# EAGLE design driver (EAGLE 9.4.0)
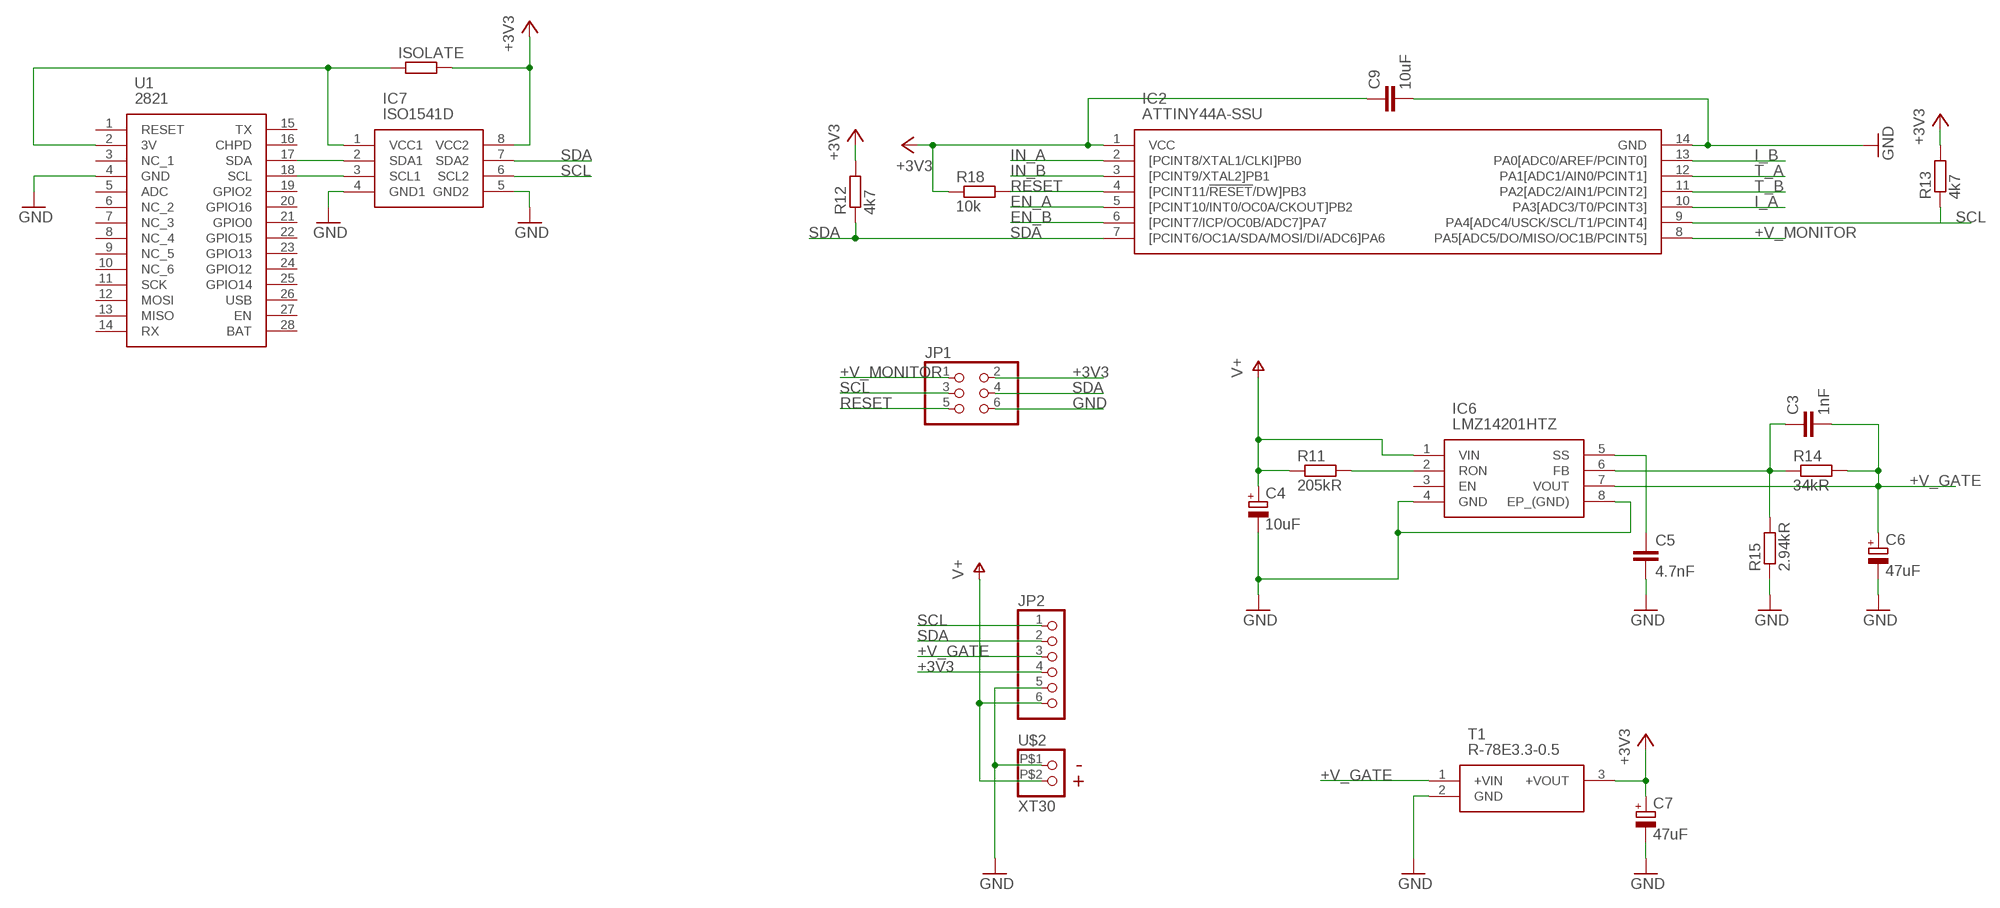
[diagram p0: schematic, sheet 1, part 1 of 2]
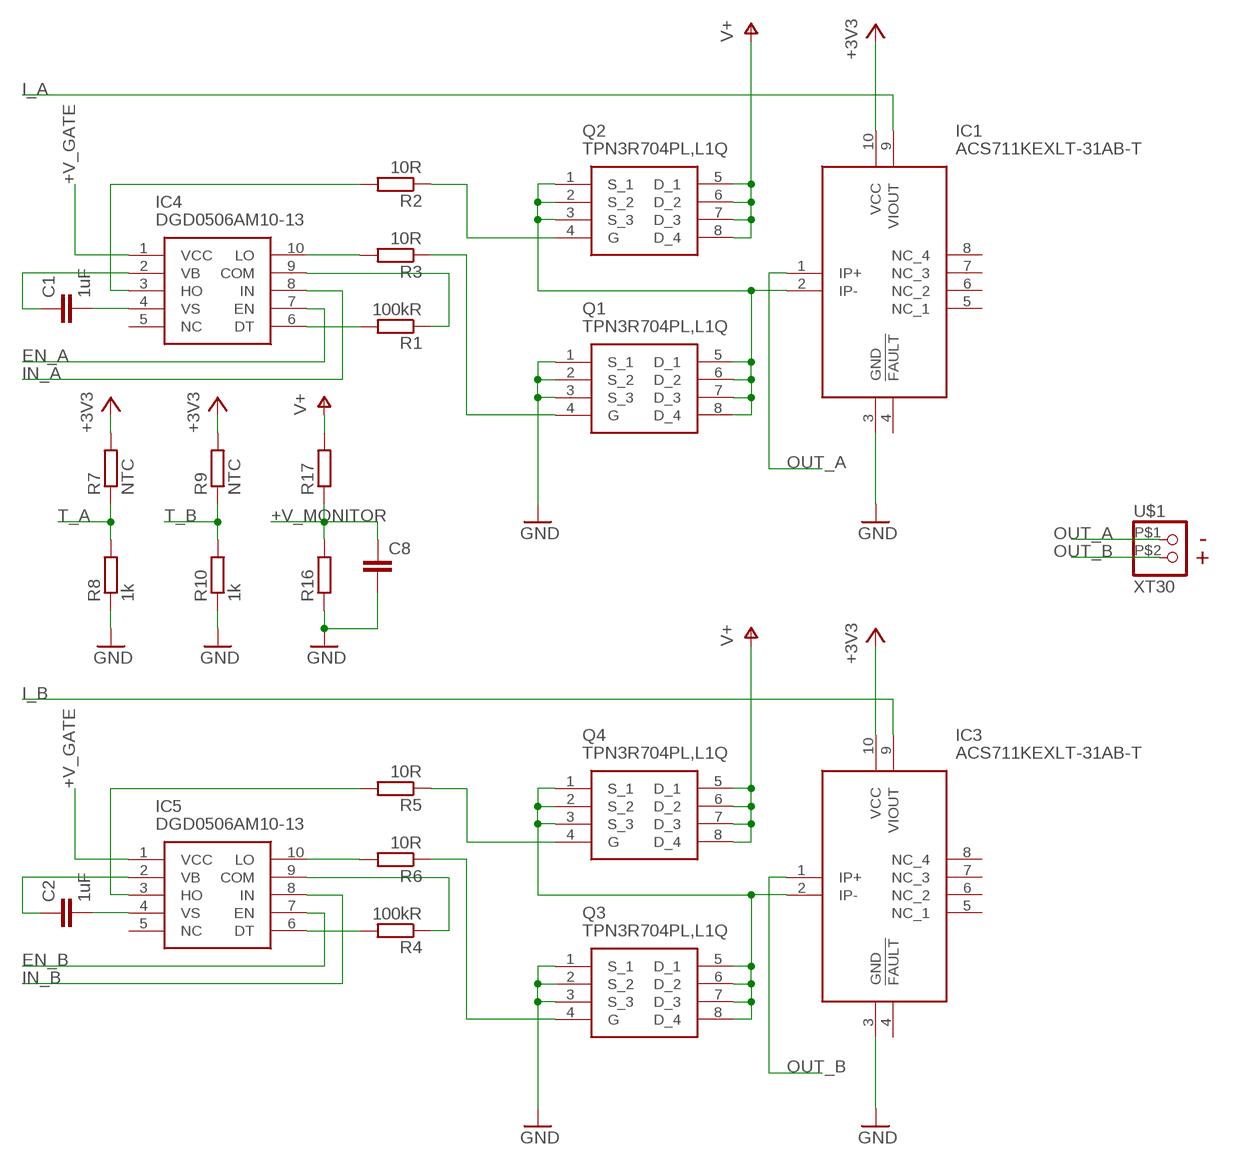
[diagram p1: schematic, sheet 1, part 2 of 2]

## Parts
C1  1uF  C-EUC0603  [C0603]
C2  1uF  C-EUC0603  [C0603]
C3  1nF  C-EUC0603  [C0603]
C4  10uF  CPOL-EUE2,5-6E  [E2,5-6E]
C5  4.7nF  C-EUC0603  [C0603]
C6  47uF  CPOL-EUE2,5-6E  [E2,5-6E]
C7  47uF  CPOL-EUE2,5-6E  [E2,5-6E]
C8  C-EUC0603  [C0603]
C9  10uF  C-EUC0603  [C0603]
IC1  ACS711KEXLT-31AB-T  [EX-PACKAGE]
IC2  ATTINY44A-SSU  [SOIC127P600X175-14N]
IC3  ACS711KEXLT-31AB-T  [EX-PACKAGE]
IC4  DGD0506AM10-13  [SOP50P490X110-10N]
IC5  DGD0506AM10-13  [SOP50P490X110-10N]
IC6  LMZ14201HTZ  [NDW0007A]
IC7  ISO1541D  [SOIC127P600X175-8N]
ISOLATE  R-EU_R0805  [R0805]
JP1  PINHD-2X3  [2X03]
JP2  PINHD-1X6  [1X06]
Q1  TPN3R704PL,L1Q  [TSON_ADVANCE]
Q2  TPN3R704PL,L1Q  [TSON_ADVANCE]
Q3  TPN3R704PL,L1Q  [TSON_ADVANCE]
Q4  TPN3R704PL,L1Q  [TSON_ADVANCE]
R1  100kR  R-EU_R0603  [R0603]
R2  10R  R-EU_R0603  [R0603]
R3  10R  R-EU_R0603  [R0603]
R4  100kR  R-EU_R0603  [R0603]
R5  10R  R-EU_R0603  [R0603]
R6  10R  R-EU_R0603  [R0603]
R7  NTC  R-EU_R0603  [R0603]
R8  1k  R-EU_R0603  [R0603]
R9  NTC  R-EU_R0603  [R0603]
R10  1k  R-EU_R0603  [R0603]
R11  205kR  R-EU_R0603  [R0603]
R12  4k7  R-EU_R0603  [R0603]
R13  4k7  R-EU_R0603  [R0603]
R14  34kR  R-EU_R0603  [R0603]
R15  2.94kR  R-EU_R0603  [R0603]
R16  R-EU_R0603  [R0603]
R17  R-EU_R0603  [R0603]
R18  10k  R-EU_R0603  [R0603]
T1  R-78E3.3-0.5  [SHDRV3W100P0_254_1X3_1160X850X]
U1  2821  [2821]
U$1  XT30  [XT30]
U$2  XT30  [XT30]

## Nets
+3V3: C7.+ C9.1 IC1.10(VCC) IC2.1(VCC) IC3.10(VCC) IC7.8(VCC2) ISOLATE.2 JP1.2 JP2.4 R7.2 R9.2 R12.2 R13.2 R18.1 T1.3(+VOUT)
+V_GATE: C3.2 C6.+ IC4.1(VCC) IC5.1(VCC) IC6.7(VOUT) JP2.3 R14.2 T1.1(+VIN)
+V_MONITOR: C8.1 IC2.8(PA5[ADC5/DO/MISO/OC1B/PCINT5]) JP1.1 R16.2 R17.1
EN_A: IC2.5([PCINT10/INT0/OC0A/CKOUT]PB2) IC4.7(EN)
EN_B: IC2.6([PCINT7/ICP/OC0B/ADC7]PA7) IC5.7(EN)
GND: C4.- C5.2 C6.- C7.- C8.2 C9.2 IC1.3(GND) IC2.14(GND) IC3.3(GND) IC6.4(GND) IC6.8(EP_(GND)) IC7.4(GND1) IC7.5(GND2) JP1.6 JP2.5 Q1.1(S_1) Q1.2(S_2) Q1.3(S_3) Q3.1(S_1) Q3.2(S_2) Q3.3(S_3) R8.1 R10.1 R15.1 R16.1 T1.2(GND) U1.4(GND) U$2.P$1
I_A: IC1.9(VIOUT) IC2.10(PA3[ADC3/T0/PCINT3])
I_B: IC2.13(PA0[ADC0/AREF/PCINT0]) IC3.9(VIOUT)
IN_A: IC2.2([PCINT8/XTAL1/CLKI]PB0) IC4.8(IN)
IN_B: IC2.3([PCINT9/XTAL2]PB1) IC5.8(IN)
N$1: IC3.2(IP-) Q3.5(D_1) Q3.6(D_2) Q3.7(D_3) Q3.8(D_4) Q4.1(S_1) Q4.2(S_2) Q4.3(S_3)
N$2: Q2.4(G) R2.1
N$3: C1.2 IC4.4(VS)
N$4: C1.1 IC4.2(VB)
N$5: Q4.4(G) R5.1
N$6: IC1.2(IP-) Q1.5(D_1) Q1.6(D_2) Q1.7(D_3) Q1.8(D_4) Q2.1(S_1) Q2.2(S_2) Q2.3(S_3)
N$7: Q1.4(G) R3.1
N$8: IC4.6(DT) R1.2
N$9: IC4.9(COM) R1.1
N$10: IC4.3(HO) R2.2
N$11: IC4.10(LO) R3.2
N$12: C2.2 IC5.4(VS)
N$13: C2.1 IC5.2(VB)
N$14: Q3.4(G) R6.1
N$15: IC5.6(DT) R4.2
N$16: IC5.9(COM) R4.1
N$17: IC5.3(HO) R5.2
N$18: IC5.10(LO) R6.2
N$19: IC7.2(SDA1) U1.17(SDA)
N$20: IC6.2(RON) R11.2
N$21: C3.1 IC6.6(FB) R14.1 R15.2
N$22: C5.1 IC6.5(SS)
N$23: IC7.3(SCL1) U1.18(SCL)
N$24: IC7.1(VCC1) ISOLATE.1 U1.2(3V)
OUT_A: IC1.1(IP+) U$1.P$1
OUT_B: IC3.1(IP+) U$1.P$2
RESET: IC2.4([PCINT11/!RESET!/DW]PB3) JP1.5 R18.2
SCL: IC2.9(PA4[ADC4/USCK/SCL/T1/PCINT4]) IC7.6(SCL2) JP1.3 JP2.1 R13.1
SDA: IC2.7([PCINT6/OC1A/SDA/MOSI/DI/ADC6]PA6) IC7.7(SDA2) JP1.4 JP2.2 R12.1
T_A: IC2.12(PA1[ADC1/AIN0/PCINT1]) R7.1 R8.2
T_B: IC2.11(PA2[ADC2/AIN1/PCINT2]) R9.1 R10.2
V+: C4.+ IC6.1(VIN) JP2.6 Q2.5(D_1) Q2.6(D_2) Q2.7(D_3) Q2.8(D_4) Q4.5(D_1) Q4.6(D_2) Q4.7(D_3) Q4.8(D_4) R11.1 R17.2 U$2.P$2
Unconnected: IC1.4(!FAULT) IC1.5(NC_1) IC1.6(NC_2) IC1.7(NC_3) IC1.8(NC_4) IC3.4(!FAULT) IC3.5(NC_1) IC3.6(NC_2) IC3.7(NC_3) IC3.8(NC_4) IC4.5(NC) IC5.5(NC) IC6.3(EN) U1.1(RESET) U1.3(NC_1) U1.5(ADC) U1.6(NC_2) U1.7(NC_3) U1.8(NC_4) U1.9(NC_5) U1.10(NC_6) U1.11(SCK) U1.12(MOSI) U1.13(MISO) U1.14(RX) U1.15(TX) U1.16(CHPD) U1.19(GPIO2) U1.20(GPIO16) U1.21(GPIO0) U1.22(GPIO15) U1.23(GPIO13) U1.24(GPIO12) U1.25(GPIO14) U1.26(USB) U1.27(EN) U1.28(BAT)

## Library data of the parts
C1-C3 C5 C8 C9 = rcl:C-EU: CAPACITOR, European symbol; SPICEPREFIX: C
C4 C6 C7 = rcl:CPOL-EU: POLARIZED CAPACITOR, European symbol; SPICEPREFIX: C
IC1 IC3 = parts:ACS711KEXLT-31AB-T: Hall-Effect Linear Current Sensor with Overcurrent Fault Output for < 100 V Isolation Applications Source: Datasheet <http://www.allegromicro.com/en/Products/Current-Sensor-ICs/Zero-To-Fifty-Amp-Integrated-Conductor-Sensor-ICs/~/media/Files/Datasheets/ACS711-Datasheet.pdf>; DESCRIPTION: Hall-Effect Linear Current Sensor with Overcurrent Fault Output for < 100 V Isolation Applications; HEIGHT: mm; MANUFACTURER_NAME: Allegro Microsystems; MANUFACTURER_PART_NUMBER: ACS711KEXLT-31AB-T
IC2 = parts:ATTINY44A-SSU: ATTINY44A-SSU, 8 bit AVR Microcontroller 20MHz 256 B, 4 kB Flash, 256 B RAM, I2C 14-Pin SOIC Source: Datasheet <http://www.atmel.com/Images/doc8183.pdf>; DESCRIPTION: ATTINY44A-SSU, 8 bit AVR Microcontroller 20MHz 256 B, 4 kB Flash, 256 B RAM, I2C 14-Pin SOIC; HEIGHT: 1.75mm; MANUFACTURER_NAME: Microchip; MANUFACTURER_PART_NUMBER: ATTINY44A-SSU; MOUSER_PART_NUMBER: 556-ATTINY44A-SSU; MOUSER_PRICE-STOCK: https://www.mouser.com/Search/Refine.aspx?Keyword=556-ATTINY44A-SSU; RS_PART_NUMBER: 1331640P; RS_PRICE-STOCK: http://uk.rs-online.com/web/p/products/1331640P
IC4 IC5 = parts:DGD0506AM10-13: Gate Drivers HV Gate Driver MSOP-10 T&R 2.5K Source: Datasheet <https://www.diodes.com/assets/Datasheets/DGD0506A.pdf>; DESCRIPTION: Gate Drivers HV Gate Driver MSOP-10 T&R 2.5K; HEIGHT: 1.1mm; MANUFACTURER_NAME: Diodes Inc.; MANUFACTURER_PART_NUMBER: DGD0506AM10-13; MOUSER_PART_NUMBER: 621-DGD0506AM10-13; MOUSER_PRICE-STOCK: https://www.mouser.com/Search/Refine.aspx?Keyword=621-DGD0506AM10-13; RS_PART_NUMBER: 1827336P; RS_PRICE-STOCK: http://uk.rs-online.com/web/p/products/1827336P
IC6 = parts:LMZ14201HTZ: TEXAS INSTRUMENTS - LMZ14201HTZ - POWER MODULE, 42V, 1A, 7TOPMOD Source: Datasheet <http://www.ti.com/lit/ds/symlink/lmz14201h.pdf>; DESCRIPTION: TEXAS INSTRUMENTS - LMZ14201HTZ - POWER MODULE, 42V, 1A, 7TOPMOD; HEIGHT: mm; MANUFACTURER_NAME: Texas Instruments; MANUFACTURER_PART_NUMBER: LMZ14201HTZ
IC7 = parts:ISO1541D: 2.5 kVrms Isolated Unidirectional Clock, Bidirectional I2C Isolators Source: Datasheet <http://www.ti.com/lit/gpn/iso1541>; DESCRIPTION: 2.5 kVrms Isolated Unidirectional Clock, Bidirectional I2C Isolators; HEIGHT: 1.75mm; MANUFACTURER_NAME: Texas Instruments; MANUFACTURER_PART_NUMBER: ISO1541D; MOUSER_PART_NUMBER: 595-ISO1541D; MOUSER_PRICE-STOCK: https://www.mouser.com/Search/Refine.aspx?Keyword=595-ISO1541D; RS_PART_NUMBER: 8253075P; RS_PRICE-STOCK: http://uk.rs-online.com/web/p/products/8253075P
ISOLATE R1-R18 = rcl:R-EU_: RESISTOR, European symbol; SPICEPREFIX: R
JP1 = pinhead:PINHD-2X3: PIN HEADER
JP2 = pinhead:PINHD-1X6: PIN HEADER
Q1-Q4 = parts:TPN3R704PL,L1Q: MOSFET 40 Volt N-Channel Source: Datasheet <https://toshiba.semicon-storage.com/info/docget.jsp?did=30643&prodName=TPN3R704PL>; DESCRIPTION: MOSFET 40 Volt N-Channel; HEIGHT: mm; MANUFACTURER_NAME: Toshiba; MANUFACTURER_PART_NUMBER: TPN3R704PL,L1Q; MOUSER_PART_NUMBER: 757-TPN3R704PLL1Q; MOUSER_PRICE-STOCK: https://www.mouser.com/Search/Refine.aspx?Keyword=757-TPN3R704PLL1Q
T1 = parts:R-78E3.3-0.5: Switching Regulator 6-28Vin 3.3Vout 0.5A Switching Regulator, 6 Source: Datasheet <http://www.recom-power.com/pdf/Innoline/R-78Exx-0.5.pdf>; DESCRIPTION: Switching Regulator 6-28Vin 3.3Vout 0.5A Switching Regulator, 6; HEIGHT: 10.4mm; MANUFACTURER_NAME: RECOM Power; MANUFACTURER_PART_NUMBER: R-78E3.3-0.5; MOUSER_PART_NUMBER: 919-R-78E3.3-0.5; MOUSER_PRICE-STOCK: https://www.mouser.com/Search/Refine.aspx?Keyword=919-R-78E3.3-0.5; RS_PART_NUMBER: 1666497; RS_PRICE-STOCK: http://uk.rs-online.com/web/p/products/1666497
U1 = parts:2821: ADAFRUIT - 2821 - Adafruit Feather HUZZAH ESP8266 Source: Datasheet <https://cdn-learn.adafruit.com/downloads/pdf/adafruit-feather-huzzah-esp8266.pdf>; ALLIED_NUMBER: 70929322; ALLIED_PRICE-STOCK: https://www.alliedelec.com/adafruit-industries-2821/70929322/; DESCRIPTION: ADAFRUIT - 2821 - Adafruit Feather HUZZAH ESP8266; HEIGHT: 4mm; MANUFACTURER_NAME: Adafruit; MANUFACTURER_PART_NUMBER: 2821; MOUSER_PART_NUMBER: 485-2821; MOUSER_PRICE-STOCK: https://www.mouser.com/Search/Refine.aspx?Keyword=485-2821; RS_PART_NUMBER: 1245505; RS_PRICE-STOCK: http://uk.rs-online.com/web/p/products/1245505
U$1 U$2 = parts:XT30

## Board
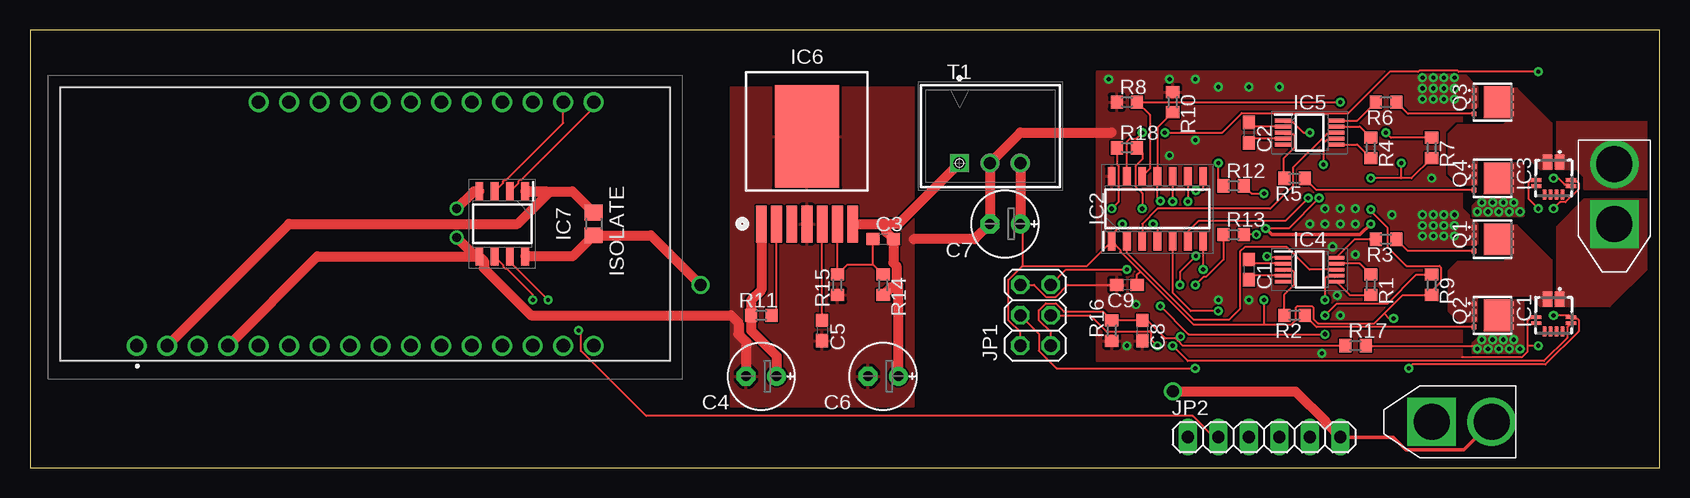
[diagram p2: board, top side]
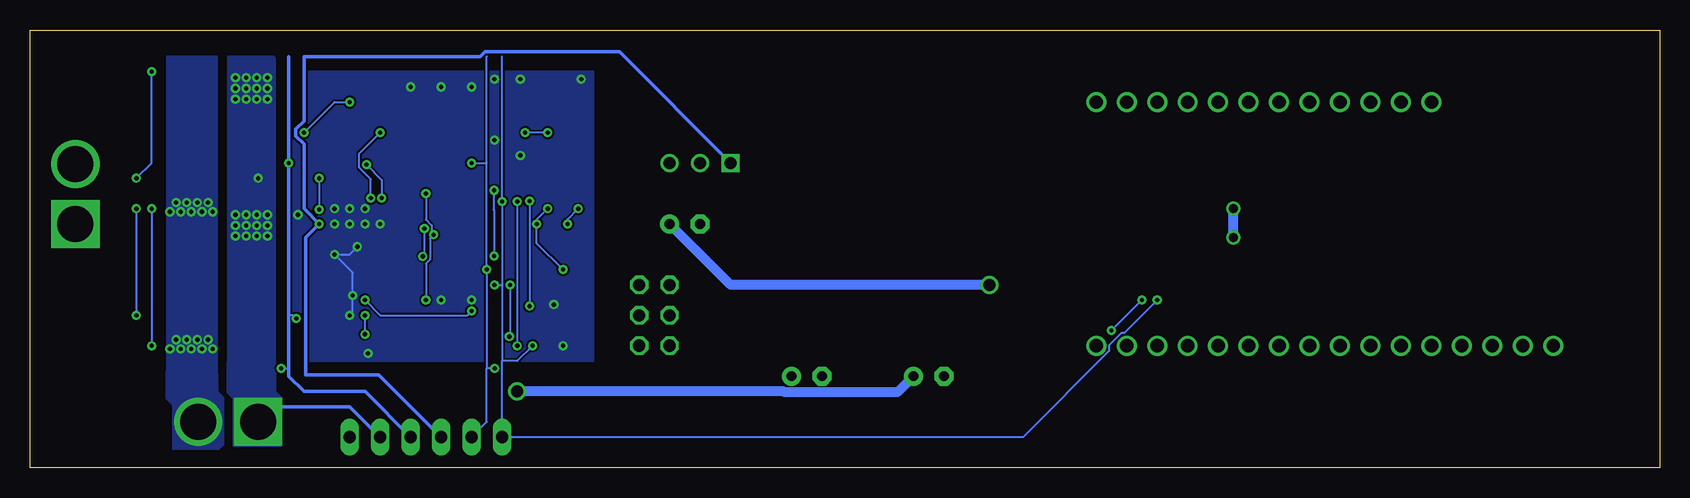
[diagram p3: board, bottom side, seen from below]

Size 135.87 x 36.5 mm. Coordinates in mm from the lower left corner, seen from the top.
Outline: 0,0 135.87,0 135.87,36.5 0,36.5 0,0
Copper layers (1*16): Top 0.035mm / dielectric 1.5mm / Bottom 0.035mm
Design rules "default": minimum track width 6mil, minimum drill 0.35mm, track to track 6mil, track to pad 6mil, pad to pad 6mil, via to via 6mil, smd to smd 6mil, copper to edge 40mil, drill to drill 6mil, minimum pad ring 10mil, minimum via ring 8mil, stop-mask expansion 4mil, vias tented up to drill 0mil, thermal gap 10mil

### Footprints (pad centres in the part's own frame; a part is rotated, then mirrored left to right if it is on the bottom)
C0603 = smd 1.1 x 1: 1 -0.85,0; 2 0.85,0
E2,5-6E = drill 0.813 pad 1.575: + -1.27,0 | drill 0.813 pad 1.575 octagon: - 1.27,0
EX-PACKAGE = smd 1.27 x 0.8: 1 -1.35,0.5; 2 -1.35,-0.5 | smd 0.3 x 0.85: 3 0.15,-1.45; 4 0.65,-1.45; 9 0.65,1.45; 10 0.15,1.45 | smd 0.85 x 0.3: 5 1.35,-0.75; 6 1.35,-0.25; 7 1.35,0.25; 8 1.35,0.75
SOIC127P600X175-14N = smd 1.528 x 0.65: 1 -2.711,3.81; 2 -2.711,2.54; 3 -2.711,1.27; 4 -2.711,0; 5 -2.711,-1.27; 6 -2.711,-2.54; 7 -2.711,-3.81; 8 2.711,-3.81; 9 2.711,-2.54; 10 2.711,-1.27; 11 2.711,0; 12 2.711,1.27; 13 2.711,2.54; 14 2.711,3.81
SOP50P490X110-10N = smd 1.4 x 0.3: 1 -2.2,1; 2 -2.2,0.5; 3 -2.2,0; 4 -2.2,-0.5; 5 -2.2,-1; 6 2.2,-1; 7 2.2,-0.5; 8 2.2,0; 9 2.2,0.5; 10 2.2,1
NDW0007A = smd 0.89 x 3.06: 1 -3.81,0; 2 -2.54,0; 3 -1.27,0; 4 0,0; 5 1.27,0; 6 2.54,0; 7 3.81,0 | smd 5.35 x 8.54: 8 0,7.305
SOIC127P600X175-8N = smd 1.525 x 0.65: 1 -2.712,1.905; 2 -2.712,0.635; 3 -2.712,-0.635; 4 -2.712,-1.905; 5 2.712,-1.905; 6 2.712,-0.635; 7 2.712,0.635; 8 2.712,1.905
R0805 = smd 1.3 x 1.5: 1 -0.95,0; 2 0.95,0
2X03 = drill 1.016 octagon: 1 -2.54,-1.27; 2 -2.54,1.27; 3 0,-1.27; 4 0,1.27; 5 2.54,-1.27; 6 2.54,1.27
1X06 = drill 1.016 long: 1 -6.35,0; 2 -3.81,0; 3 -1.27,0; 4 1.27,0; 5 3.81,0; 6 6.35,0
TSON_ADVANCE = smd 0.4 x 0.4: 1 -0.975,-1.55; 2 -0.325,-1.55; 3 0.325,-1.55; 4 0.975,-1.55 | smd 0.4 x 0.3: 5 0.975,1.6; 6 0.325,1.6; 7 -0.325,1.6; 8 -0.975,1.6 | smd 2.65 x 2.2: 9 0,0.35
R0603 = smd 1 x 1.1: 1 -0.85,0; 2 0.85,0
SHDRV3W100P0_254_1X3_1160X850X = drill 1 pad 1.5 square: 1 0,0 | drill 1 pad 1.5: 2 2.54,0; 3 5.08,0
2821 = drill 1.11 pad 1.665: 1 -35.56,0; 2 -33.02,0; 3 -30.48,0; 4 -27.94,0; 5 -25.4,0; 6 -22.86,0; 7 -20.32,0; 8 -17.78,0; 9 -15.24,0; 10 -12.7,0; 11 -10.16,0; 12 -7.62,0; 13 -5.08,0; 14 -2.54,0; 15 0,0; 16 2.54,0; 17 2.54,20.32; 18 0,20.32; 19 -2.54,20.32; 20 -5.08,20.32; 21 -7.62,20.32; 22 -10.16,20.32; 23 -12.7,20.32; 24 -15.24,20.32; 25 -17.78,20.32; 26 -20.32,20.32; 27 -22.86,20.32; 28 -25.4,20.32
XT30 = drill 3 square: P$1 0,0 | drill 3: P$2 5,0

### Placement (x,y rotation side)
C1  101.6,16.51 270 top
C2  101.6,27.94 270 top
C3  71.12,19.05 0 top
C4  60.96,7.62 180 top
C5  66.04,11.43 270 top
C6  71.12,7.62 180 top
C7  81.28,20.32 180 top
C8  92.71,11.43 270 top
C9  91.44,15.24 180 top
IC1  127,12.7 270 top
IC2  93.98,21.59 90 top
IC3  127,24.13 270 top
IC4  106.68,16.51 0 top
IC5  106.68,27.94 0 top
IC6  64.77,20.32 0 top
IC7  39.37,20.32 270 top
ISOLATE  46.99,20.32 270 top
JP1  83.82,12.7 90 top
JP2  102.87,2.54 0 top
Q1  121.92,19.05 270 top
Q2  121.92,12.7 270 top
Q3  121.92,30.48 270 top
Q4  121.92,24.13 270 top
R1  111.76,15.24 270 top
R2  105.41,12.7 180 top
R3  113.03,19.05 180 top
R4  111.76,26.67 270 top
R5  105.41,24.13 180 top
R6  113.03,30.48 180 top
R7  116.84,26.67 270 top
R8  91.44,30.48 0 top
R9  116.84,15.24 270 top
R10  95.25,30.48 270 top
R11  60.96,12.7 0 top
R12  100.33,23.49 0 top
R13  100.33,19.43 0 top
R14  71.12,15.24 270 top
R15  67.31,15.24 90 top
R16  90.17,11.43 90 top
R17  110.49,10.16 0 top
R18  91.44,26.67 0 top
T1  77.47,25.4 0 top
U1  44.45,10.16 0 top
U$1  132.08,20.32 90 top
U$2  116.84,3.81 0 top

### Tracks (layer width: path | path; a pad name or v marks a point on that pad's centre or on a via)
+3V3  (via drill 0.35, 1)
  Top 0.152: IC2.1 90.89,18.16 90.89,18.02 92.55,16.35 | 92.55,16.35 96.98,11.92 102.87,11.92 | 102.87,11.92 105.16,11.92 105.53,12.3 105.53,13.34 105.67,13.48 106.86,13.48 106.99,13.34 106.99,12.4 107.36,12.03 112.07,12.03 112.88,12.85 | 112.88,12.85 114.43,14.39 R9.2 116.84,14.72 117.62,15.5 117.62,16.68 117.48,16.82 114.74,16.82 113.15,18.41 113.15,20.01 111.76,21.4 v111.76,21.53 | v127,21.59 127.54,22.13 128,22.13 129.1,23.23 129.1,23.72 128.97,23.86 128.57,23.86 IC3.10 | R7.2 115.15,24.13 114.3,24.13 | 114.3,24.13 v111.76,24.13 | v113.67,12.45 113.28,12.45 112.88,12.85 | 114.3,24.13 v114.3,25.4 | v114.94,8.28 115.24,8.59 126.31,8.59 129.1,11.37 129.1,12.3 128.97,12.43 128.57,12.43 IC1.10 128.3,12.7 v127,12.7 | R12.2 101.81,22.86 v102.87,22.86 | v102.23,19.42 R13.2 | v102.87,13.97 102.87,11.92 | C9.1 92.29,16.09 92.55,16.35 | R18.1 90.59,25.29 90.72,25.16 90.72,22.14 v90.17,21.59 | v91.06,20.32 90.17,19.43 IC2.1 | IC2.1 88.11,16.82 82.72,16.82 | 82.72,16.82 81.56,15.65 81.56,12.29 82.55,11.3 JP1.2 | C7.+ 82.72,20.15 82.72,16.82
  Top 0.813: T1.3 C7.+ | IC7.8 45.23,17.61 ISOLATE.2 51.75,19.37 v55.88,15.24
  Bottom 0.152: v127,21.59 v127,12.7 | v111.76,24.13 v111.76,21.53 | v113.67,12.45 113.92,12.7 114.3,12.7 | v114.94,8.28 114.33,8.28 114.3,8.25 | v102.87,22.86 102.87,20.67 102.39,20.19 102.39,19.59 v102.23,19.42 102.52,19.13 102.52,17.36 102.87,17.01 v102.87,13.97 | v91.06,20.32 91.06,20.7 v90.17,21.59
  Bottom 0.305: 114.3,34.29 v114.3,25.4 114.3,12.7 114.3,8.25 114.3,7.62 113.03,6.35 107.95,6.35 JP2.4
  Bottom 0.813: v55.88,15.24 77.47,15.24 C7.+
+V_GATE  (via drill 0.35)
  Top 0.152: IC4.1 103.23,17.51 v103.12,17.62 | IC5.1 104.6,28.82 105.28,28.82 106.15,27.94 v106.68,27.94 | v107.46,22.48 104.92,19.94 v103,19.94
  Top 0.305: v103,19.94 103.5,19.43 110.87,19.43 v111.76,20.32
  Top 0.813: IC6.7 70.84,20.32 | 70.84,20.32 71.38,19.78 71.38,19.64 C3.2 71.97,17.08 72.23,16.82 72.23,15.36 | 72.23,15.36 71.9,15.03 71.76,15.03 R14.2 | C6.+ 72.39,15.2 72.23,15.36 | T1.1 72.39,20.32 70.84,20.32
  Bottom 0.152: v103,19.94 103,17.74 v103.12,17.62 | v107.46,22.48 107.46,24.05 108.43,25.02 108.43,26.19 v106.68,27.94
  Bottom 0.305: JP2.3 106.81,7.75 112.9,7.75 112.9,19.18 v111.76,20.32 113.03,21.59 113.03,26.97 113.71,27.66 113.71,28.22 113.03,28.91 113.03,34.29 98.33,34.29 97.95,34.67 86.74,34.67 T1.1
+V_MONITOR  (via drill 0.35)
  Top 0.152: R17.1 96.11,10.16 95.68,10.59 | 95.68,10.59 95.5,10.77 94.64,10.77 92.71,12.7 C8.1 90.59,12.28 90.17,12.7 R16.2 89.44,13 86.19,13 85.5,13.69 84.68,13.69 84.1,13.11 84.1,12.29 85.09,11.3 JP1.1 | IC2.8 97.79,23.12 v97.18,23.12 | v97.18,17.65 95.86,16.32 v95.86,15.24 | v95.91,10.93 95.91,10.82 95.68,10.59
  Bottom 0.152: v97.18,23.12 97.18,22.9 97.23,22.9 97.23,21.49 97.18,21.49 v97.18,17.65 | v95.86,15.24 95.86,10.98 v95.91,10.93
EN_A  (via drill 0.35)
  Top 0.152: IC4.7 108.76,15.89 108.08,15.89 107.95,15.75 v107.95,13.97 | v99.05,13.05 96.76,13.05 95.25,14.57 IC2.5
  Bottom 0.152: v107.95,13.97 106.68,12.7 99.4,12.7 v99.05,13.05
EN_B  (via drill 0.35)
  Top 0.152: IC5.7 108.76,27.32 108.08,27.32 107.82,27.06 v107.82,25.27 | v106.55,22.47 104.65,20.57 97.41,20.57 96.52,19.68 IC2.6
  Bottom 0.152: v107.82,25.27 106.55,24 v106.55,22.47
GND  (via drill 0.35, 0.75)
  Top 0.152: IC1.3 125.43,12.43 125.03,12.43 124.81,12.21 124.81,10.16 | 124.81,10.16 124.81,9.66 124.35,9.2 119.38,9.2 | IC3.3 125.43,23.86 125.03,23.86 124.9,23.72 124.9,22.42 v125.73,21.59 | v125.73,10.16 124.81,10.16 | JP1.6 83.69,15.24 84.68,14.25 85.5,14.25 86.49,15.24 C9.2
  Top 0.813: 73.66,19.05 78.74,19.05 C7.- T1.2 82.55,27.94 90.17,27.94 | U1.4 23.96,17.61 IC7.5 | IC7.5 37.85,17.22 37.85,16.61 41.77,12.7 58.42,12.7 59.05,12.07 59.05,11.12 59.69,10.48 C4.- | IC7.5 37.13,17.61 v35.56,19.18 | v35.56,21.59 37,23.03 IC7.4
  Bottom 0.152: v125.73,21.59 v125.73,10.16 | v109.22,12.7 108.97,12.95 v108.97,14.35 108.97,16.26 v110.49,17.78 109.22,17.78 v108.58,18.41
  Bottom 0.305: JP2.5 109.22,5.08 115.57,5.08 U$2.P$1
  Bottom 0.813: v35.56,19.18 v35.56,21.59
  other vias: 116.08,21.08 116.97,21.08 117.86,21.08 118.75,21.08 116.08,20.19 116.97,20.19 117.86,20.19 118.75,20.19 116.08,19.3 116.97,19.3 117.86,19.3 118.75,19.3 116.08,32.51 116.97,32.51 117.86,32.51 118.75,32.51 116.08,31.62 116.97,31.62 117.86,31.62 118.75,31.62 116.08,30.73 116.97,30.73 117.86,30.73 118.75,30.73 116.84,24.13 99.06,13.97 101.6,13.97 109.22,21.59 110.49,21.59 107.95,21.59 106.68,20.32 107.95,20.32 109.22,20.32 110.49,20.32 107.7,9.53 92.2,13.59 89.92,32.38 95,32.38 95,26.04 97.16,32.38 97.16,27.3 113.54,21.08 99.06,31.75 101.6,31.75 104.14,31.75 91.44,10.16
  pour Top (rank 2, no thermals): 120.52,29.97 116.08,29.97 115.57,30.48 115.57,33.02 119.38,33.02 120.65,31.75 120.65,30.1
  pour Top (rank 2, no thermals): 120.52,18.54 116.08,18.54 115.57,19.05 115.57,21.59 119.38,21.59 120.65,20.32 120.65,18.67
  pour Bottom (rank 2): 119.38,34.29 119.38,7.62 115.44,7.62 115.44,34.16 115.57,34.29
  pour Top (rank 3): 119.38,33.02 88.9,33.02 88.9,8.89 119.38,8.89
  pour Bottom (rank 3): 88.9,33.02 115.57,33.02 115.57,8.89 88.9,8.89
  pour Top (rank 4): 58.42,31.75 73.66,31.75 73.66,5.08 58.42,5.08
  pour Bottom (no thermals): 115.44,8.76 115.44,6.35 114.94,5.84 114.94,1.78 118.87,1.78 118.87,5.71 119.38,6.22 119.38,8.76
I_A  (via drill 0.35)
  Top 0.152: IC1.9 128.13,11.73 128.13,10.83 126.19,8.89 96.52,8.89 v95.25,10.16 | v95.25,22.2 IC2.10
  Bottom 0.152: v95.25,22.2 v95.25,10.16
I_B  (via drill 0.35)
  Top 0.152: v92.71,27.94 92.22,27.45 91.69,27.45 91.44,27.19 IC2.13 | v94.59,27.94 99.38,27.94 101,29.57 109.89,29.57 113.35,33.02 115.73,33.02 115.83,33.12 119,33.12 119.09,33.02 v125.73,33.02 | IC3.9 128.33,23.6 127.93,23.6 127.4,24.13 v127,24.13
  Bottom 0.152: v92.71,27.94 v94.59,27.94 | v127,24.13 125.73,25.4 v125.73,33.02
IN_A
  Top 0.152: IC4.8 106.65,16.51 104.77,18.39 101.26,18.39 100.87,18 100.87,13.24 99.95,12.32 97.02,12.32 91.44,17.9 IC2.2
IN_B
  Top 0.152: IC5.8 108.76,27.82 108.08,27.82 105.29,25.02 105.29,23.48 103.39,21.59 93.98,21.59 92.71,20.32 IC2.3
N$1
  pour Top (isolate 0.152, no thermals): 119.13,23.62 120.65,23.62 120.65,25.65 120.78,25.78 124.97,25.78 125.86,24.89 126.87,24.89 126.87,28.7 123.95,31.62 123.32,31.62 123.32,29.08 122.81,28.57 119,28.57 118.24,27.81 118.24,24.51
N$2
  Top 0.152: Q2.4 107.23,11.73 R2.1
N$3
  Top 0.152: IC4.4 101.95,16.01 C1.2
N$4
  Top 0.152: IC4.2 101.95,17.01 C1.1
N$5
  Top 0.152: Q4.4 107.23,23.15 R5.1
N$6
  pour Top (isolate 0.152, no thermals): 119.13,12.19 120.65,12.19 120.65,14.22 120.78,14.35 124.97,14.35 125.86,13.46 126.87,13.46 126.87,17.27 123.95,20.19 123.32,20.19 123.32,17.65 122.81,17.14 119,17.14 118.24,16.38 118.24,13.08
N$7
  Top 0.152: Q1.4 114.86,18.07 R3.1
N$8
  Top 0.152: IC4.6 110,14.39 R1.2
N$9
  Top 0.152: R1.1 110.84,17.01 IC4.9
N$10
  Top 0.152: R2.2 104.56,14.42 105.41,15.27 105.41,16.25 105.28,16.39 104.6,16.39 IC4.3
N$11
  Top 0.152: IC4.10 110.42,19.05 R3.2
N$12
  Top 0.152: IC5.4 101.6,27.44 C2.2
N$13
  Top 0.152: IC5.2 101.6,28.44 C2.1
N$14
  Top 0.152: Q3.4 114.86,29.5 R6.1
N$15
  Top 0.152: IC5.6 110.64,26.94 R4.2
N$16
  Top 0.152: IC5.9 110.84,28.44 R4.1
N$17
  Top 0.152: R5.2 104.48,24.21 104.48,25.77 105.41,26.7 105.41,27.68 105.28,27.82 104.6,27.82 IC5.3
N$18
  Top 0.152: IC5.10 110.64,28.94 R6.2
N$19
  Top 0.152: U1.17 46.99,30.02 41,24.02 40.85,24.02 40.72,23.89 40.72,23.75 IC7.2
N$20
  Top 0.152: R11.2 62.23,13.12 IC6.2
N$21
  Top 0.152: IC6.6 R15.2 68.16,16.93 70.28,16.93 | R14.1 70.28,16.93 | 70.28,16.93 70.27,16.94 C3.1
N$22
  Top 0.152: C5.1 IC6.5
N$23
  Top 0.152: U1.18 44.45,28.75 39.73,24.02 39.59,24.02 39.45,23.89 39.45,23.75 IC7.3
N$24
  Top 0.813: ISOLATE.1 45.23,23.03 IC7.1 43.01,23.03 43.18,22.86 40.64,20.32 21.59,20.32 U1.2
OUT_A
  pour Top (no thermals): 131.7,13.46 135,16.76 135,22.35 129.54,22.35 127.25,20.07 127.25,13.46
OUT_B
  pour Top (no thermals): 127.25,24.89 128.91,24.89 129.54,24.26 129.54,23.24 135.13,23.24 135.13,28.83 127.25,28.83
RESET  (via drill 0.35)
  Top 0.152: R18.2 92.71,26.25 92.71,25.71 92.16,25.16 92.16,23.44 92.71,22.89 v92.71,21.59 | v93.63,20.32 93.98,19.97 IC2.4 | JP1.5 86.36,16.51 v91.44,16.51
  Bottom 0.152: v92.71,21.59 93.63,20.67 v93.63,20.32 93.63,18.7 v91.44,16.51
SCL  (via drill 0.35)
  Top 0.152: IC2.9 v96.52,22.2 | v97.16,15.24 97.82,15.9 98.04,15.9 99.48,17.34 R13.1 | v93.98,10.16 93.44,10.7 93.44,11.23 93.31,11.36 89.72,11.36 88.38,12.7 JP1.3 | v41.91,13.97 41.91,14.43 39.73,16.62 39.59,16.62 39.45,16.75 39.45,16.89 IC7.6
  Bottom 0.152: 96.52,15.24 v96.52,22.2 96.52,34.29 | 96.52,15.24 96.52,8.89 | v97.16,15.24 96.52,15.24 | v93.98,10.16 95.25,8.89 96.52,8.89 | 96.52,8.89 JP2.1 53.11,2.54 45.93,9.72 45.93,10.18 44.89,11.22 44.66,11.22 v41.91,13.97
SDA  (via drill 0.35)
  Top 0.152: IC2.7 v97.79,16.51 | R12.1 99.06,23.91 v99.06,25.4 | JP1.4 84.1,11.15 84.1,9.75 85.57,8.28 v97.13,8.28 | JP2.2 98.68,2.54 96.93,4.29 51.36,4.29 45.93,9.72 45.93,11.22 v45.72,11.43 | v43.18,13.97 40.01,17.14 IC7.7
  Bottom 0.152: 97.79,8.25 v97.79,16.51 97.79,25.4 | 97.79,25.4 97.79,34.29 | v99.06,25.4 97.79,25.4 | v97.13,8.28 97.76,8.28 97.79,8.25 | JP2.2 97.79,3.81 97.79,8.25 | v45.72,11.43 v43.18,13.97
T_A  (via drill 0.35)
  Top 0.152: R7.1 113.45,27.52 v113.03,27.94 | IC2.12 93.34,24.94 93.34,29.43 R8.2 v109.22,30.48
  Bottom 0.152: v113.03,27.94 110.49,30.48 v109.22,30.48
T_B  (via drill 0.35)
  Top 0.152: v107.95,12.7 108.91,13.66 113.14,13.66 115.57,16.09 R9.1 | R10.2 93.98,28.36 IC2.11 93.98,22.48 v94.23,22.22 | v107.95,11.12 96.58,11.12 v94.23,13.46
  Bottom 0.152: v107.95,11.12 v107.95,12.7 | v94.23,22.22 v94.23,13.46
V+  (via drill 0.35, 1)
  Top 0.152: R17.2 120.4,10.16 v120.65,9.91
  Top 0.305: JP2.6 113.66,2.54 114.71,1.5 119.53,1.5 U$2.P$2
  Top 0.813: IC6.1 60.96,14.82 60.11,13.97 R11.1 60.11,11.43 62.23,9.31 C4.+ | JP2.6 108,3.76 108,3.85 105.5,6.35 v95.25,6.35
  Bottom 0.813: C4.+ 63.58,6.27 72.95,6.27 73.02,6.35 v95.25,6.35
  other vias: 121.03,22.1 120.65,21.34 121.54,21.34 121.92,22.1 122.43,21.34 122.81,22.1 123.32,21.34 123.7,22.1 124.21,21.34 121.03,10.67 121.54,9.91 121.92,10.67 122.43,9.91 122.81,10.67 123.32,9.91 123.7,10.67 124.21,9.91
  pour Top (no thermals): 121.28,25.4 124.46,25.4 124.46,20.95 120.27,20.95 120.27,21.84 121.16,22.73 121.16,25.27
  pour Top (no thermals): 121.28,13.97 124.46,13.97 124.46,9.53 120.27,9.53 120.27,10.41 121.16,11.3 121.16,13.84
  pour Bottom: 120.27,34.29 124.46,34.29 124.46,7.62 120.27,7.62
  pour Bottom (no thermals): 120.14,1.52 123.95,1.52 123.95,5.21 124.46,5.71 124.46,8 120.52,8 120.27,7.75 120.27,6.35 119.76,5.84 119.76,1.91